# Altium schematic sheet carriage_connector.SchDoc
size A4; SheetNumber: 1; SheetTotal: 1
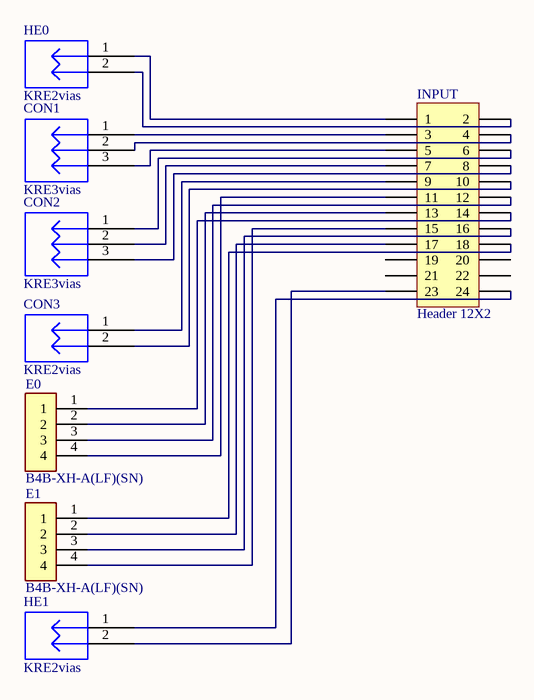
[diagram p0: carriage_connector.SchDoc]

## Parts
CON1  KRE3vias  [KRE3-3vias]
CON2  KRE3vias  [KRE3-3vias]
CON3  KRE2vias  [KRE2-2vias]
E0  B4B-XH-A(LF)(SN)  [JST_B4B-XH-A(LF)(SN)]
E1  B4B-XH-A(LF)(SN)  [JST_B4B-XH-A(LF)(SN)]
HE0  KRE2vias  [KRE2-2vias]
HE1  KRE2vias  [KRE2-2vias]
INPUT  Header 12X2  [HDR2X12]

## Nets
NetCON1_1: CON1.1 INPUT.3
NetCON1_2: CON1.2 INPUT.4
NetCON1_3: CON1.3 INPUT.5
NetCON2_1: CON2.1 INPUT.6
NetCON2_2: CON2.2 INPUT.7
NetCON2_3: CON2.3 INPUT.8
NetCON3_1: CON3.1 INPUT.9
NetCON3_2: CON3.2 INPUT.10
NetE0_1: E0.1 INPUT.14
NetE0_2: E0.2 INPUT.13
NetE0_3: E0.3 INPUT.12
NetE0_4: E0.4 INPUT.11
NetE1_1: E1.1 INPUT.18
NetE1_2: E1.2 INPUT.17
NetE1_3: E1.3 INPUT.16
NetE1_4: E1.4 INPUT.15
NetHE0_1: HE0.1 INPUT.1
NetHE0_2: HE0.2 INPUT.2
NetHE1_1: HE1.1 INPUT.24
NetHE1_2: HE1.2 INPUT.23

Not connected (* = marked no-connect by the designer): INPUT 19 20 21 22

## Library data of the parts
CON1 CON2 = KRE3vias: Conector 3 vias; Descrição: Conector KRE 3 vias 180º; Encapsulamento: PTH - 180º; Modelo: 3 vias - 180º; Marca: *; Observação: *
CON3 HE0 HE1 = KRE2vias: Conector 2 vias; Descrição: Conector KRE 2 vias 180º; Encapsulamento: PTH - 180º; Modelo: 2 vias - 180º; Marca: *; Observação: *
E0 E1 = B4B-XH-A(LF)(SN): Connector Header Through Hole 4 position 0.098 _2.50mm_; MP: B4B-XH-A_LF__SN_; MF: JST Sales; Price: None; Package: None; Value: *; Availability: Unavailable; SnapEDA_Link: https://www.snapeda.com/parts/B4B-XH-A%28LF%29%28SN%29/JST%20Sales%20America%20Inc./view-part/447494/?ref=snap
INPUT = Header 12X2: Header, 12-Pin, Dual row; LatestRevisionDate: 17-Jul-2002; LatestRevisionNote: Re-released for DXP Platform.; Publisher: Altium Limited